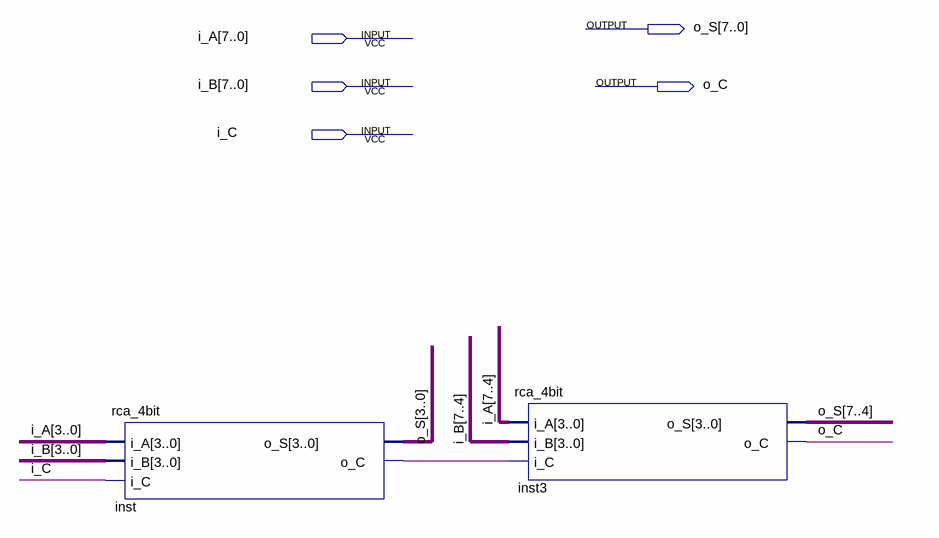
[diagram p0: schematic sheet]
// Quartus schematic rca_8bit.bdf as structural Verilog: 2 symbols, 5 pins
module rca_8bit (
  input  [7:0] i_A,
  input  [7:0] i_B,
  input  i_C,
  output [7:0] o_S,
  output o_C
);

  wire inst_o_c;

  rca_4bit inst (.i_A(i_A[3:0]), .i_B(i_B[3:0]), .i_C(i_C), .o_S(o_S[3:0]), .o_C(inst_o_c));
  rca_4bit inst3 (.i_A(i_A[7:4]), .i_B(i_B[7:4]), .i_C(inst_o_c), .o_S(o_S[7:4]), .o_C(o_C));
endmodule
